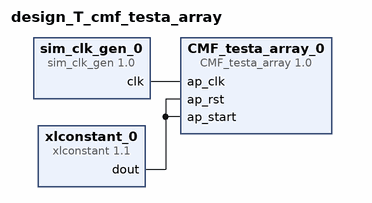
[diagram p0: block diagram of the top level]
# Vivado block design design_T_cmf_testa_array, xc7z020clg484-1, Vivado 2018.3
create_bd_design design_T_cmf_testa_array

create_bd_cell -type ip -vlnv xilinx.com:ip:sim_clk_gen:1.0 sim_clk_gen_0
set_property -dict {CONFIG.RESET_POLARITY ACTIVE_HIGH} [get_bd_cells sim_clk_gen_0]
create_bd_cell -type ip -vlnv xilinx.com:ip:xlconstant:1.1 xlconstant_0
create_bd_cell -type ip -vlnv xilinx.com:user:CMF_testa_array:1.0 CMF_testa_array_0

# ---- connections ----

connect_bd_net [get_bd_pins sim_clk_gen_0/clk] [get_bd_pins CMF_testa_array_0/ap_clk]
connect_bd_net [get_bd_pins xlconstant_0/dout] [get_bd_pins CMF_testa_array_0/ap_start] [get_bd_pins CMF_testa_array_0/ap_rst]

validate_bd_design
save_bd_design
